# Altium schematic sheet Launchpad_Header.SchDoc
size A; SheetNumber: 3; SheetTotal: 3
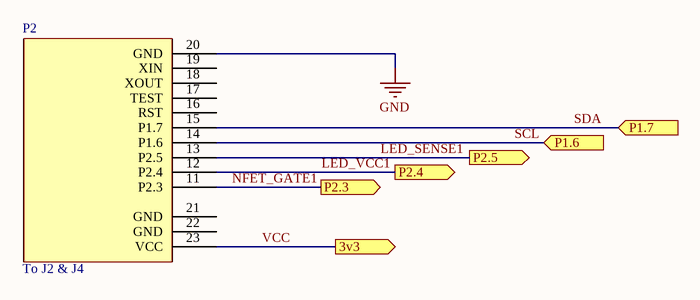
[diagram p0: Launchpad_Header.SchDoc]

## Parts
P2  To J2 & J4  [MSP-EXP430G2 Mating Headers for J2/J4]

## Ports
3v3 (out, see Temperature_Sensor[3B]), P1.6 (in, see Temperature_Sensor[3C]), P1.7 (in, see Temperature_Sensor[3C]), P2.3 (out), P2.4 (out), P2.5 (out, see LEDs[1B])

## Nets
GND: P2.20(GND)
LED_SENSE1: P2.13(P2.5) ; port P2.5
LED_VCC1: P2.12(P2.4) ; port P2.4
NFET_GATE1: P2.11(P2.3) ; port P2.3
SCL: P2.14(P1.6) ; port P1.6
SDA: P2.15(P1.7) ; port P1.7
VCC: P2.23(VCC) ; port 3v3

Not connected (* = marked no-connect by the designer): P2 16(RST) 17(TEST) 18(XOUT) 19(XIN) 21(GND) 22(GND)

## Library data of the parts
P2 = CMP-004-000015-1: Female Mating Headers for MSP-EXP430G2 J2 & J4 / (can use Würth Elektronik 61301011121 and 61300311121); Manufacturer: URC; Pin Count: 13; Component Type: Standard; Manufacturer Part Number: N/A; Value: N/A; Source: URC.SchLib; Design Item ID: MSP-EXP430G2 Mating Headers for J2/J4